# Altium schematic sheet v1.1.SchDoc
size 177 x 55 mm
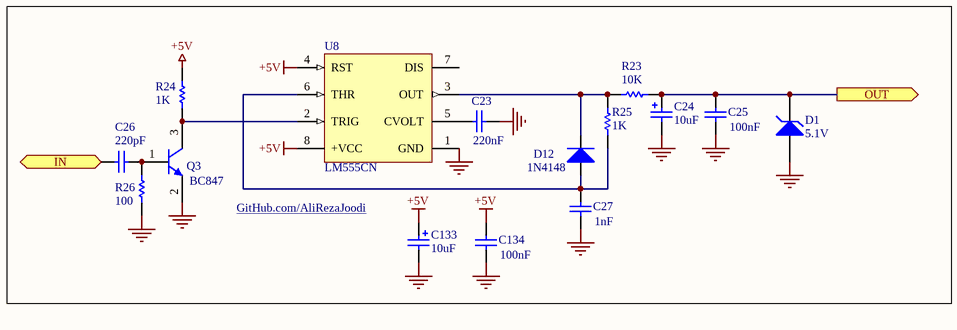
[diagram p0: v1.1.SchDoc]

## Parts
C23  value 220nF  [RESC3216N]  (hidden comment: Cap)
C24  value 10uF  [Cap_B]  (hidden comment: Cap Pol1)
C25  value 100nF  [0805]  (hidden comment: Cap)
C26  value 220pF  [RESC3216N]  (hidden comment: Cap)
C27  value 1nF  [RESC3216N]  (hidden comment: Cap)
C133  value 10uF  [Cap_B]  (hidden comment: Capacitor)
C134  value 100nF  [0805]  (hidden comment: Cap)
D1  value 5.1V  [MELF-D3516-1406]  (hidden comment: Diode)
D12  value 1N4148  [0805_Diode]  (hidden comment: Diode)
Q3  value BC847  [SOT23-3N]  (hidden comment: NPN)
R23  value 10K  [0805]  (hidden comment: Res1)
R24  value 1K  [0805]  (hidden comment: Res1)
R25  value 1K  [0805]  (hidden comment: Res1)
R26  value 100  [0805]  (hidden comment: Res1)
U8  LM555CN  [SOP127P636-8N]

## Ports
IN (in), OUT (out)

## Nets
+5V: C133.1 C134.1 R24.1 U8.4(RST) U8.8(+VCC)
GND: C23.1 C24.2 C25.2 C27.2 C133.2 C134.2 D1.1(A) Q3.2(E) R26.2 U8.1(GND)
IN: C26.2 ; port IN
OUT: C24.1 C25.1 D1.2(K) R23.2 ; port OUT
NetC23_2: C23.2 U8.5(CVOLT)
NetC26_1: C26.1 Q3.1(B) R26.1
NetC27_1: C27.1 D12.1(A) R25.1 U8.6(THR)
NetD12_2: D12.2(K) R23.1 R25.2 U8.3(OUT)
NetQ3_3: Q3.3(C) R24.2 U8.2(TRIG)

Not connected (* = marked no-connect by the designer): U8 7(DIS)

## Notes on the sheet
- GitHub.com/AliRezaJoodi

## Library data of the parts
C23 C25-C27 C134 = Cap: Capacitor; Published: 8-Jun-2000; LatestRevisionDate: 17-Jul-2002; LatestRevisionNote: Re-released for DXP Platform.; PackageReference: RAD-0.3; Publisher: Altium Limited
C24 C133 = Cap Pol1: Polarized Capacitor (Radial); Manufacturer: Generic Components; Class I: Passive; Published: 8-Jun-2000; Revision: July-2002: Re-released for DXP Platform.; Publisher: Altium Limited; Class II: Capacitor
D1 = D Zener: Zener Diode; Manufacturer: Generic Components; Class I: Discrete; Class II: Diode - Zener; Published: 8-Jun-2000; Revision: July-2002: Re-released for DXP Platform.; Publisher: Altium Limited
D12 = Diode: Default Diode; Manufacturer: Generic Components; Class I: Discrete; Class II: Diode - Switching; Published: 8-Jun-2000; Revision: July-2002: Re-released for DXP Platform.; Publisher: Altium Limited
Q3 = BC847: Silicon Bipolar Transistor
R23-R26 = Res1: Resistor; Published: 8-Jun-2000; LatestRevisionDate: 17-Jul-2002; LatestRevisionNote: Re-released for DXP Platform.; PackageReference: AXIAL-0.3; Publisher: Altium Limited
U8 = LM555CN: Timer; Manufacturer: National Semiconductor; CompType: Analog IC; PackageTopMarking: NSUZXYTT*LM*555CN; PowerWise: N; Published: 4-Dec-2008; DatasheetVersion: Jul-2006; PackageVersion: revG, May-2006; PackageReference: N08E; Publisher: Altium Limited; PackageDescription: MDIP, .365 x .250 x .130in, 8 Lead, .100in Pitch; PartNumber: LM555CN; PinCount: 8; DigiKeyPartNumber: LM555CNNS-ND; Code_JEDEC: MS-001-BA; ComponentLink1Description: LM555 Datasheet; ComponentLink1URL: http://www.national.com/ds.cgi/LM/LM555.pdf; ComponentLink2Description: LM555 Web Page; ComponentLink2URL: http://www.national.com/pf/LM/LM555.html; ComponentLink3Description: N08E package page; ComponentLink3URL: http://www.national.com/packaging/folders/n08e.html